# Altium schematic sheet vme_can_vme_2.SchDoc: =GlobalProjectName
size 410 x 297 mm; SheetNumber: 3; SheetTotal: 8; PageSetup: Record=PageOptions|CenterHorizontal=True|CenterVertical=True|PrintScale=1.00|XCorrection=1.00|YCorrection=1.00|PrintKind=1|BorderSize=5000000|LeftOffset=0|BottomOffset=0|Orientation=2|PaperLength=1000|PaperWidth=1000|Scale=100|PaperSource=15|PrintQuality=1200|MediaType=1|DitherType=10|PaperKind=A3|PrintScaleMode=1; Weight: -; ScaleFactor: -
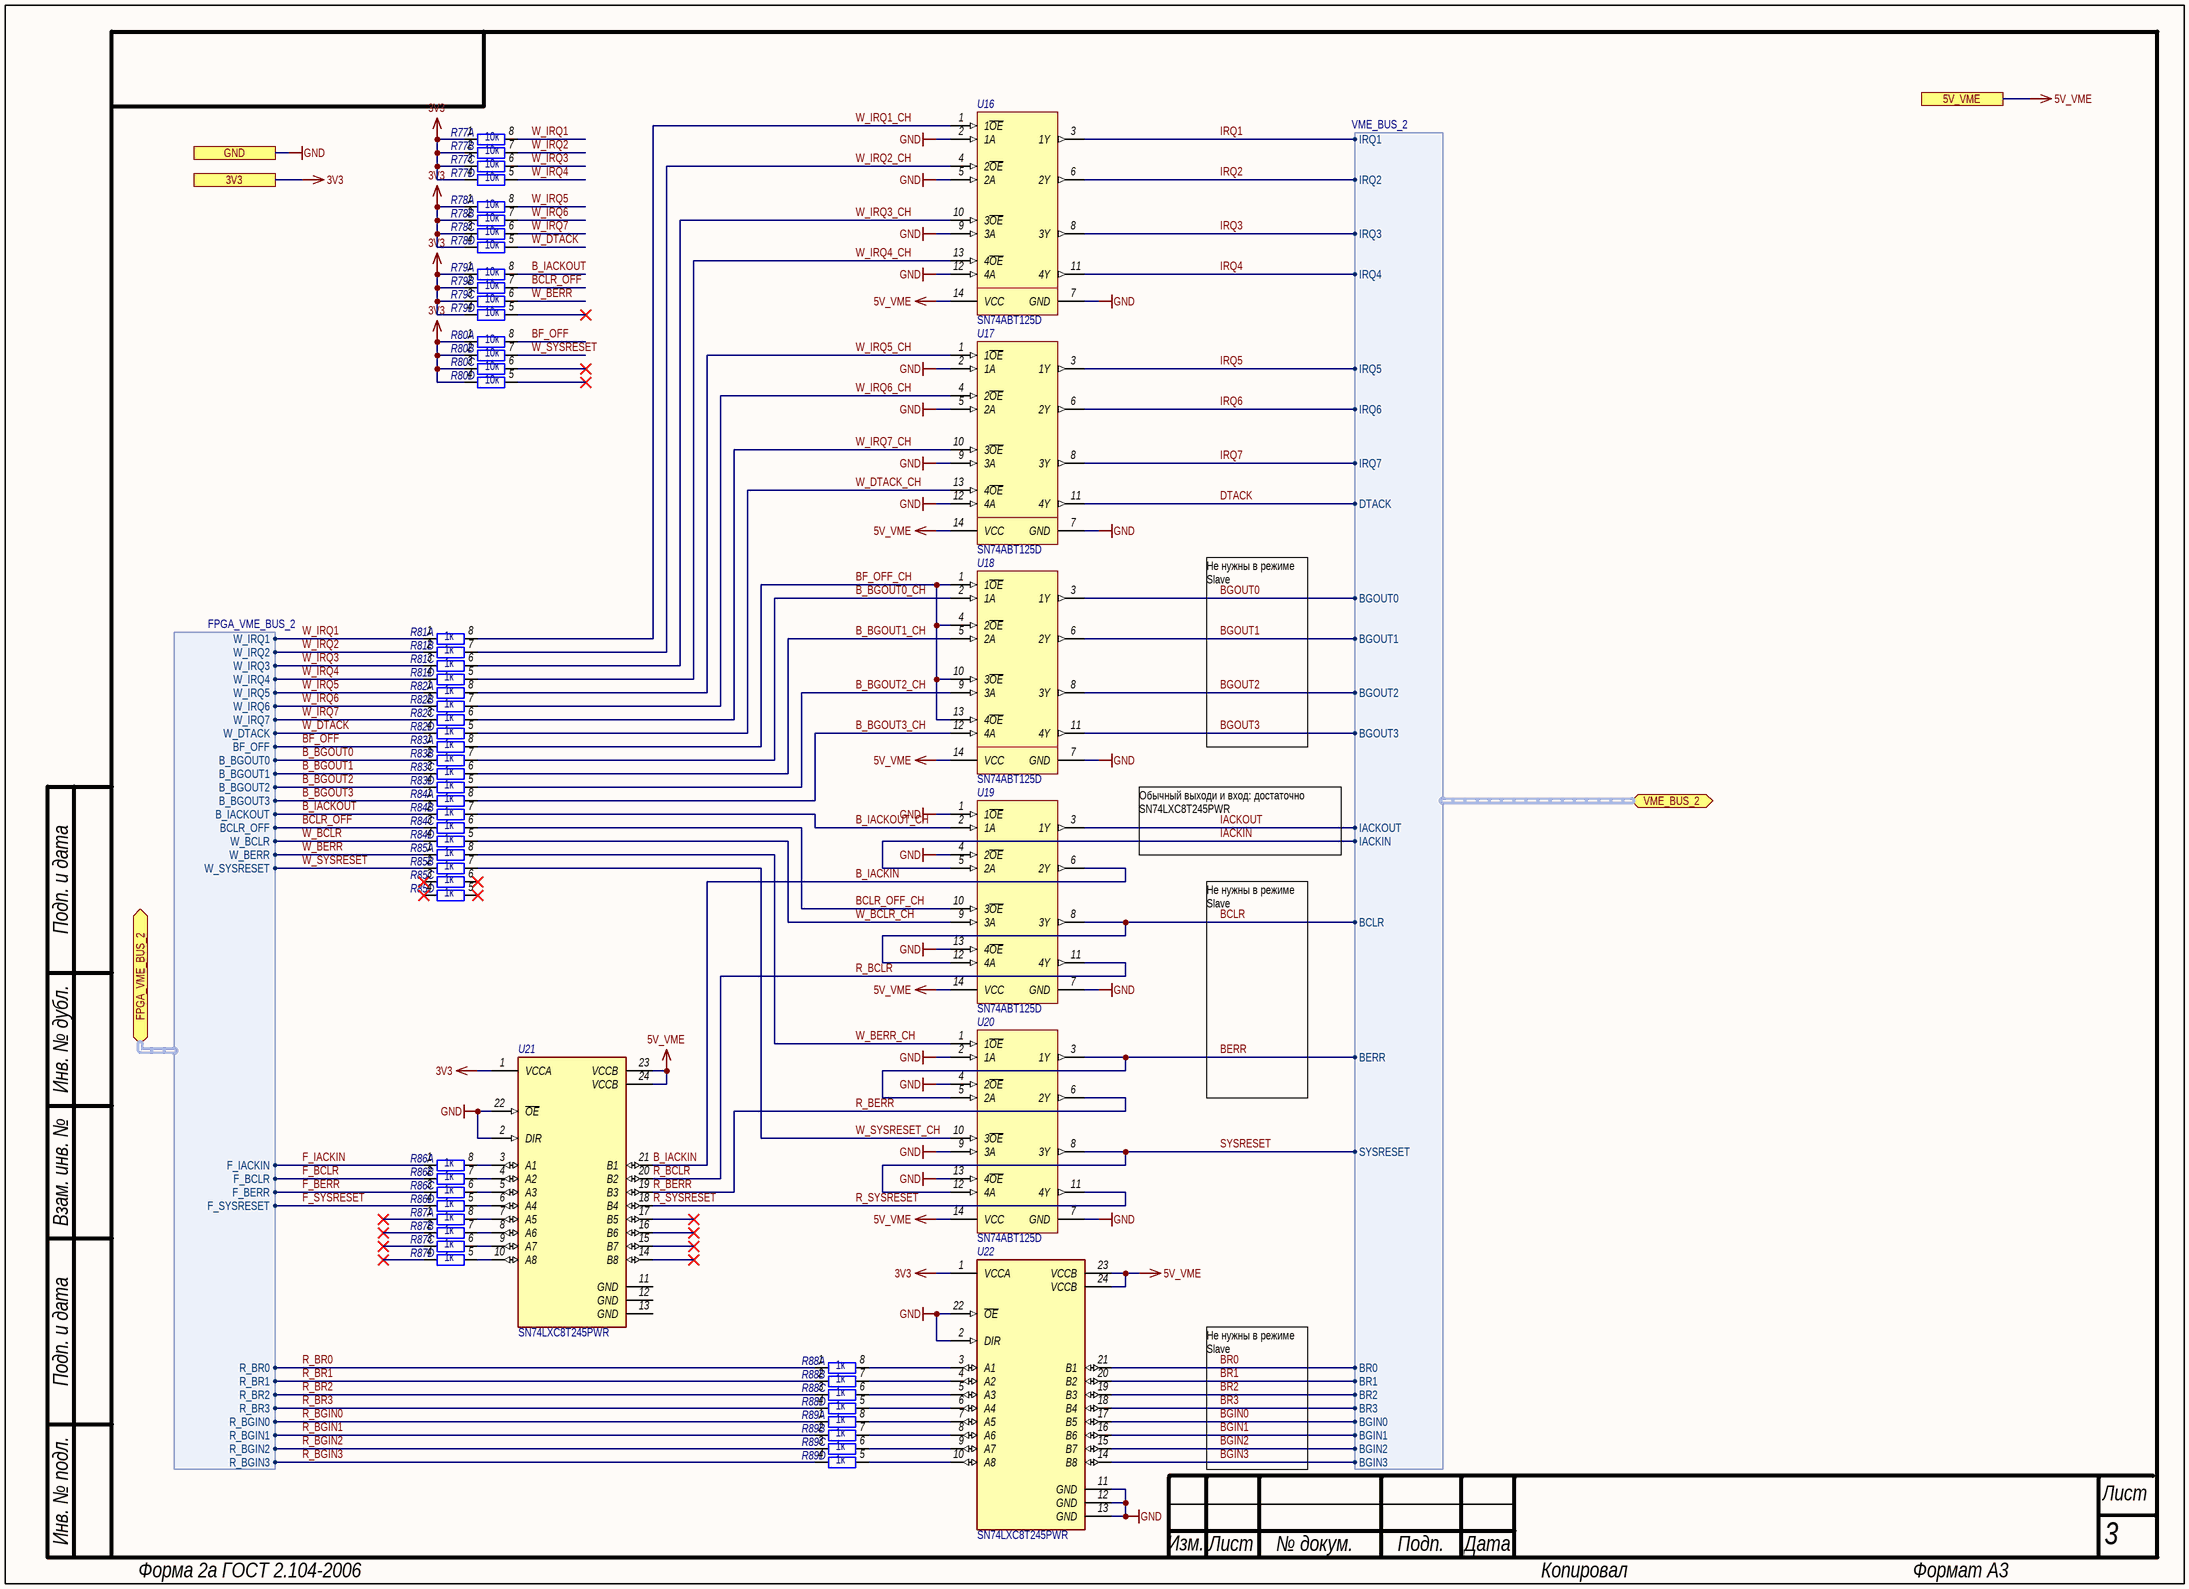
[diagram p0: vme_can_vme_2.SchDoc]

## Parts
R77  value 10к  [TC124]  (hidden comment: 4 Chip Resistor Array)  (parts A,B,C,D of 4)
R78  value 10к  [TC124]  (hidden comment: 4 Chip Resistor Array)  (parts A,B,C,D of 4)
R79  value 10к  [TC124]  (hidden comment: 4 Chip Resistor Array)  (parts A,B,C,D of 4)
R80  value 10к  [TC124]  (hidden comment: 4 Chip Resistor Array)  (parts A,B,C,D of 4)
R81  value 1к  [TC124]  (hidden comment: 4 Chip Resistor Array)  (parts A,B,C,D of 4)
R82  value 1к  [TC124]  (hidden comment: 4 Chip Resistor Array)  (parts A,B,C,D of 4)
R83  value 1к  [TC124]  (hidden comment: 4 Chip Resistor Array)  (parts A,B,C,D of 4)
R84  value 1к  [TC124]  (hidden comment: 4 Chip Resistor Array)  (parts A,B,C,D of 4)
R85  value 1к  [TC124]  (hidden comment: 4 Chip Resistor Array)  (parts A,B,C,D of 4)
R86  value 1к  [TC124]  (hidden comment: 4 Chip Resistor Array)  (parts A,B,C,D of 4)
R87  value 1к  [TC124]  (hidden comment: 4 Chip Resistor Array)  (parts A,B,C,D of 4)
R88  value 1к  [TC124]  (hidden comment: 4 Chip Resistor Array)  (parts A,B,C,D of 4)
R89  value 1к  [TC124]  (hidden comment: 4 Chip Resistor Array)  (parts A,B,C,D of 4)
U16  SN74ABT125D  [SOIC-14]
U17  SN74ABT125D  [SOIC-14]
U18  SN74ABT125D  [SOIC-14]
U19  SN74ABT125D  [SOIC-14]
U20  SN74ABT125D  [SOIC-14]
U21  SN74LXC8T245PWR  [TSSOP-24]
U22  SN74LXC8T245PWR  [TSSOP-24]

## Ports
3V3, 5V_VME, FPGA_VME_BUS_2 (bidir, harness FPGA_VME_BUS_2), GND, VME_BUS_2 (bidir, harness VME_BUS_2)

## Harnesses
VME_BUS_2: IRQ1, IRQ2, IRQ3, IRQ4, IRQ5, IRQ6, IRQ7, DTACK, BGOUT0, BGOUT1, BGOUT2, BGOUT3, IACKOUT, IACKIN, BCLR, BERR, SYSRESET, BR0, BR1, BR2, BR3, BGIN0, BGIN1, BGIN2, BGIN3
FPGA_VME_BUS_2: W_IRQ1, W_IRQ2, W_IRQ3, W_IRQ4, W_IRQ5, W_IRQ6, W_IRQ7, W_DTACK, BF_OFF, B_BGOUT0, B_BGOUT1, B_BGOUT2, B_BGOUT3, B_IACKOUT, BCLR_OFF, W_BCLR, W_BERR, W_SYSRESET, F_IACKIN, F_BCLR, F_BERR, F_SYSRESET, R_BR0, R_BR1, R_BR2, R_BR3, R_BGIN0, R_BGIN1, R_BGIN2, R_BGIN3

## Nets
3V3: R77.1 R77.2 R77.3 R77.4 R78.1 R78.2 R78.3 R78.4 R79.1 R79.2 R79.3 R79.4 R80.1 R80.2 R80.3 R80.4 U21.1(VCCA) U22.1(VCCA) ; port 3V3
5V_VME: U16.14(VCC) U17.14(VCC) U18.14(VCC) U19.14(VCC) U20.14(VCC) U21.23(VCCB) U21.24(VCCB) U22.23(VCCB) U22.24(VCCB) ; port 5V_VME
GND: U16.2(1A) U16.5(2A) U16.7(GND) U16.9(3A) U16.12(4A) U17.2(1A) U17.5(2A) U17.7(GND) U17.9(3A) U17.12(4A) U18.7(GND) U19.1(1~{OE}) U19.4(2~{OE}) U19.7(GND) U19.13(4~{OE}) U20.2(1A) U20.4(2~{OE}) U20.7(GND) U20.9(3A) U20.13(4~{OE}) U21.2(DIR) U21.22(~{OE}) U22.2(DIR) U22.11(GND) U22.12(GND) U22.13(GND) U22.22(~{OE}) ; port GND
B_BGOUT0: R83.2 ; port FPGA_VME_BUS_2.B_BGOUT0
B_BGOUT0_CH: R83.7 U18.2(1A)
B_BGOUT1: R83.3 ; port FPGA_VME_BUS_2.B_BGOUT1
B_BGOUT1_CH: R83.6 U18.5(2A)
B_BGOUT2: R83.4 ; port FPGA_VME_BUS_2.B_BGOUT2
B_BGOUT2_CH: R83.5 U18.9(3A)
B_BGOUT3: R84.1 ; port FPGA_VME_BUS_2.B_BGOUT3
B_BGOUT3_CH: R84.8 U18.12(4A)
B_IACKIN: U19.6(2Y) U21.21(B1)
B_IACKOUT: R79.8 R84.2 ; port FPGA_VME_BUS_2.B_IACKOUT
B_IACKOUT_CH: R84.7 U19.2(1A)
BCLR: U19.8(3Y) U19.12(4A) ; port VME_BUS_2.BCLR
BCLR_OFF: R79.7 R84.3 ; port FPGA_VME_BUS_2.BCLR_OFF
BCLR_OFF_CH: R84.6 U19.10(3~{OE})
BERR: U20.3(1Y) U20.5(2A) ; port VME_BUS_2.BERR
BF_OFF: R80.8 R83.1 ; port FPGA_VME_BUS_2.BF_OFF
BF_OFF_CH: R83.8 U18.1(1~{OE}) U18.4(2~{OE}) U18.10(3~{OE}) U18.13(4~{OE})
BGIN0: U22.17(B5) ; port VME_BUS_2.BGIN0
BGIN1: U22.16(B6) ; port VME_BUS_2.BGIN1
BGIN2: U22.15(B7) ; port VME_BUS_2.BGIN2
BGIN3: U22.14(B8) ; port VME_BUS_2.BGIN3
BGOUT0: U18.3(1Y) ; port VME_BUS_2.BGOUT0
BGOUT1: U18.6(2Y) ; port VME_BUS_2.BGOUT1
BGOUT2: U18.8(3Y) ; port VME_BUS_2.BGOUT2
BGOUT3: U18.11(4Y) ; port VME_BUS_2.BGOUT3
BR0: U22.21(B1) ; port VME_BUS_2.BR0
BR1: U22.20(B2) ; port VME_BUS_2.BR1
BR2: U22.19(B3) ; port VME_BUS_2.BR2
BR3: U22.18(B4) ; port VME_BUS_2.BR3
DTACK: U17.11(4Y) ; port VME_BUS_2.DTACK
F_BCLR: R86.2 ; port FPGA_VME_BUS_2.F_BCLR
F_BERR: R86.3 ; port FPGA_VME_BUS_2.F_BERR
F_IACKIN: R86.1 ; port FPGA_VME_BUS_2.F_IACKIN
F_SYSRESET: R86.4 ; port FPGA_VME_BUS_2.F_SYSRESET
IACKIN: U19.5(2A) ; port VME_BUS_2.IACKIN
IACKOUT: U19.3(1Y) ; port VME_BUS_2.IACKOUT
IRQ1: U16.3(1Y) ; port VME_BUS_2.IRQ1
IRQ2: U16.6(2Y) ; port VME_BUS_2.IRQ2
IRQ3: U16.8(3Y) ; port VME_BUS_2.IRQ3
IRQ4: U16.11(4Y) ; port VME_BUS_2.IRQ4
IRQ5: U17.3(1Y) ; port VME_BUS_2.IRQ5
IRQ6: U17.6(2Y) ; port VME_BUS_2.IRQ6
IRQ7: U17.8(3Y) ; port VME_BUS_2.IRQ7
R_BCLR: U19.11(4Y) U21.20(B2)
R_BERR: U20.6(2Y) U21.19(B3)
R_BGIN0: R89.1 ; port FPGA_VME_BUS_2.R_BGIN0
R_BGIN1: R89.2 ; port FPGA_VME_BUS_2.R_BGIN1
R_BGIN2: R89.3 ; port FPGA_VME_BUS_2.R_BGIN2
R_BGIN3: R89.4 ; port FPGA_VME_BUS_2.R_BGIN3
R_BR0: R88.1 ; port FPGA_VME_BUS_2.R_BR0
R_BR1: R88.2 ; port FPGA_VME_BUS_2.R_BR1
R_BR2: R88.3 ; port FPGA_VME_BUS_2.R_BR2
R_BR3: R88.4 ; port FPGA_VME_BUS_2.R_BR3
R_SYSRESET: U20.11(4Y) U21.18(B4)
SYSRESET: U20.8(3Y) U20.12(4A) ; port VME_BUS_2.SYSRESET
W_BCLR: R84.4 ; port FPGA_VME_BUS_2.W_BCLR
W_BCLR_CH: R84.5 U19.9(3A)
W_BERR: R79.6 R85.1 ; port FPGA_VME_BUS_2.W_BERR
W_BERR_CH: R85.8 U20.1(1~{OE})
W_DTACK: R78.5 R82.4 ; port FPGA_VME_BUS_2.W_DTACK
W_DTACK_CH: R82.5 U17.13(4~{OE})
W_IRQ1: R77.8 R81.1 ; port FPGA_VME_BUS_2.W_IRQ1
W_IRQ1_CH: R81.8 U16.1(1~{OE})
W_IRQ2: R77.7 R81.2 ; port FPGA_VME_BUS_2.W_IRQ2
W_IRQ2_CH: R81.7 U16.4(2~{OE})
W_IRQ3: R77.6 R81.3 ; port FPGA_VME_BUS_2.W_IRQ3
W_IRQ3_CH: R81.6 U16.10(3~{OE})
W_IRQ4: R77.5 R81.4 ; port FPGA_VME_BUS_2.W_IRQ4
W_IRQ4_CH: R81.5 U16.13(4~{OE})
W_IRQ5: R78.8 R82.1 ; port FPGA_VME_BUS_2.W_IRQ5
W_IRQ5_CH: R82.8 U17.1(1~{OE})
W_IRQ6: R78.7 R82.2 ; port FPGA_VME_BUS_2.W_IRQ6
W_IRQ6_CH: R82.7 U17.4(2~{OE})
W_IRQ7: R78.6 R82.3 ; port FPGA_VME_BUS_2.W_IRQ7
W_IRQ7_CH: R82.6 U17.10(3~{OE})
W_SYSRESET: R80.7 R85.2 ; port FPGA_VME_BUS_2.W_SYSRESET
W_SYSRESET_CH: R85.7 U20.10(3~{OE})
NetR86_5: R86.5 U21.6(A4)
NetR86_6: R86.6 U21.5(A3)
NetR86_7: R86.7 U21.4(A2)
NetR86_8: R86.8 U21.3(A1)
NetR87_5: R87.5 U21.10(A8)
NetR87_6: R87.6 U21.9(A7)
NetR87_7: R87.7 U21.8(A6)
NetR87_8: R87.8 U21.7(A5)
NetR88_5: R88.5 U22.6(A4)
NetR88_6: R88.6 U22.5(A3)
NetR88_7: R88.7 U22.4(A2)
NetR88_8: R88.8 U22.3(A1)
NetR89_5: R89.5 U22.10(A8)
NetR89_6: R89.6 U22.9(A7)
NetR89_7: R89.7 U22.8(A6)
NetR89_8: R89.8 U22.7(A5)

Not connected (* = marked no-connect by the designer): R79 5*; R80 5* 6*; R85 3* 4* 5* 6*; R87 1* 2* 3* 4*; U21 11(GND) 12(GND) 13(GND) 14(B8)* 15(B7)* 16(B6)* 17(B5)*

## Notes on the sheet
- Не нужны в режиме Slave
- Обычный выходи и вход: достаточно SN74LXC8T245PWR
- Подп. и дата
- Инв. № дубл.
- Взам. инв. №
- Инв. № подл.
- Изм.
- Лист
- № докум.
- Подп.
- Дата
- Форма 2а ГОСТ 2.104-2006
- Копировал
- Формат А3

## Library data of the parts
R77-R89 = Resistor-4: Потребление, Вт: 0.0; Назначение: 4 Chip Resistor Array; Наименование: 4 Chip Resistor Array
U16-U20 = SN74ABT125D: QUADRUPLE BUS BUFFER GATES; Потребление, Вт: 0.15; Назначение: QUADRUPLE BUS BUFFER GATES; ComponentLink1Description: DataSheet; ComponentLink1URL: https://www.ti.com/lit/ds/scbs182i/scbs182i.pdf; Наименование: SN74ABT125D
U21 U22 = SN74LXC8T245PWR: Dual-Supply Bus Transceiver with Configurable Level Shifting / and 3-State Outputs; Потрбление, Вт: 0.01; ComponentLink2Description: Datasheet; ComponentLink2URL: http://www.ti.com/lit/ds/symlink/sn74lxc8t245.pdf; Назначение: Dual-Supply Bus Transceiver with Configurable Level Shifting; Наименование: SN74LXC8T245PWR